# Altium schematic sheet USB_Booster.schdoc
size 179 x 138 mm
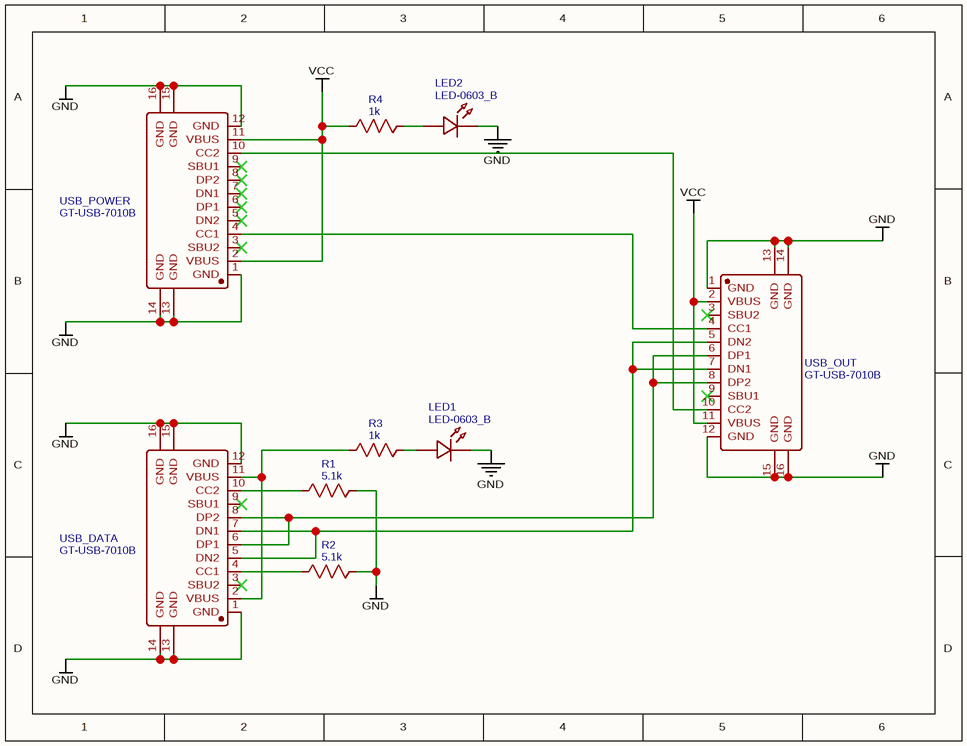
[diagram p0: USB_Booster.schdoc]

## Parts
LED1  LED-0603_B  [LED0603_BLUE]
LED2  LED-0603_B  [LED0603_BLUE]
R1  5.1k  [R0603]
R2  5.1k  [R0603]
R3  1k  [R0603]
R4  1k  [R0603]
USB_DATA  GT-USB-7010B  [USB-SMD_GT-USB-7010B]
USB_OUT  GT-USB-7010B  [USB-SMD_GT-USB-7010B]
USB_POWER  GT-USB-7010B  [USB-SMD_GT-USB-7010B]

## Nets
GND: LED1.2 LED2.2 R1.2 R2.2 USB_DATA.1(GND) USB_DATA.12(GND) USB_DATA.13(GND) USB_DATA.14(GND) USB_DATA.15(GND) USB_DATA.16(GND) USB_OUT.1(GND) USB_OUT.12(GND) USB_OUT.13(GND) USB_OUT.14(GND) USB_OUT.15(GND) USB_OUT.16(GND) USB_POWER.1(GND) USB_POWER.12(GND) USB_POWER.13(GND) USB_POWER.14(GND) USB_POWER.15(GND) USB_POWER.16(GND)
VCC: R4.1 USB_OUT.2(VBUS) USB_OUT.11(VBUS) USB_POWER.2(VBUS) USB_POWER.11(VBUS)
NetLED1_1: LED1.1 R3.2
NetLED2_1: LED2.1 R4.2
NetR1_1: R1.1 USB_DATA.10(CC2)
NetR2_1: R2.1 USB_DATA.4(CC1)
NetR3_1: R3.1 USB_DATA.2(VBUS) USB_DATA.11(VBUS)
NetUSB_DATA_5: USB_DATA.5(DN2) USB_DATA.7(DN1) USB_OUT.5(DN2) USB_OUT.7(DN1)
NetUSB_DATA_6: USB_DATA.6(DP1) USB_DATA.8(DP2) USB_OUT.6(DP1) USB_OUT.8(DP2)
NetUSB_OUT_4: USB_OUT.4(CC1) USB_POWER.4(CC1)
NetUSB_OUT_10: USB_OUT.10(CC2) USB_POWER.10(CC2)

Not connected (* = marked no-connect by the designer): USB_DATA 3(SBU2)* 9(SBU1)*; USB_OUT 3(SBU2)* 9(SBU1)*; USB_POWER 3(SBU2)* 5(DN2)* 6(DP1)* 7(DN1)* 8(DP2)* 9(SBU1)*

## Library data of the parts
LED1 LED2 = LED-0603_B: BOM_Manufacturer: EVERLIGHT(台湾亿光); BOM_Manufacturer Part: 19-217/BHC-ZL1M2RY/3T; Contributor: LCEDA_01; BOM_Supplier Part: C72041; BOM_Supplier: LCSC; spicePre: L; spiceSymbolName: LED-0603_B
R1 R2 = 5.1k: nameAlias: Value(Ω); Contributor: LCEDA_Lib; spicePre: R; spiceSymbolName: R_0603_US
R3 R4 = 1k: nameAlias: Value(Ω); Contributor: LCEDA_Lib; spicePre: R; spiceSymbolName: R_0603_US
USB_DATA USB_OUT USB_POWER = GT-USB-7010B: BOM_Manufacturer: G-Switch(品赞); Contributor: LCSC; BOM_Supplier: LCSC; BOM_Supplier Part: C2837092; BOM_Manufacturer Part: GT-USB-7010B; BOM_JLCPCB Part Class: Extended Part; spicePre: U; spiceSymbolName: GT-USB-7010B